# EAGLE design H08R60 (EAGLE 9.2.2)

## Sheet 1 of 2
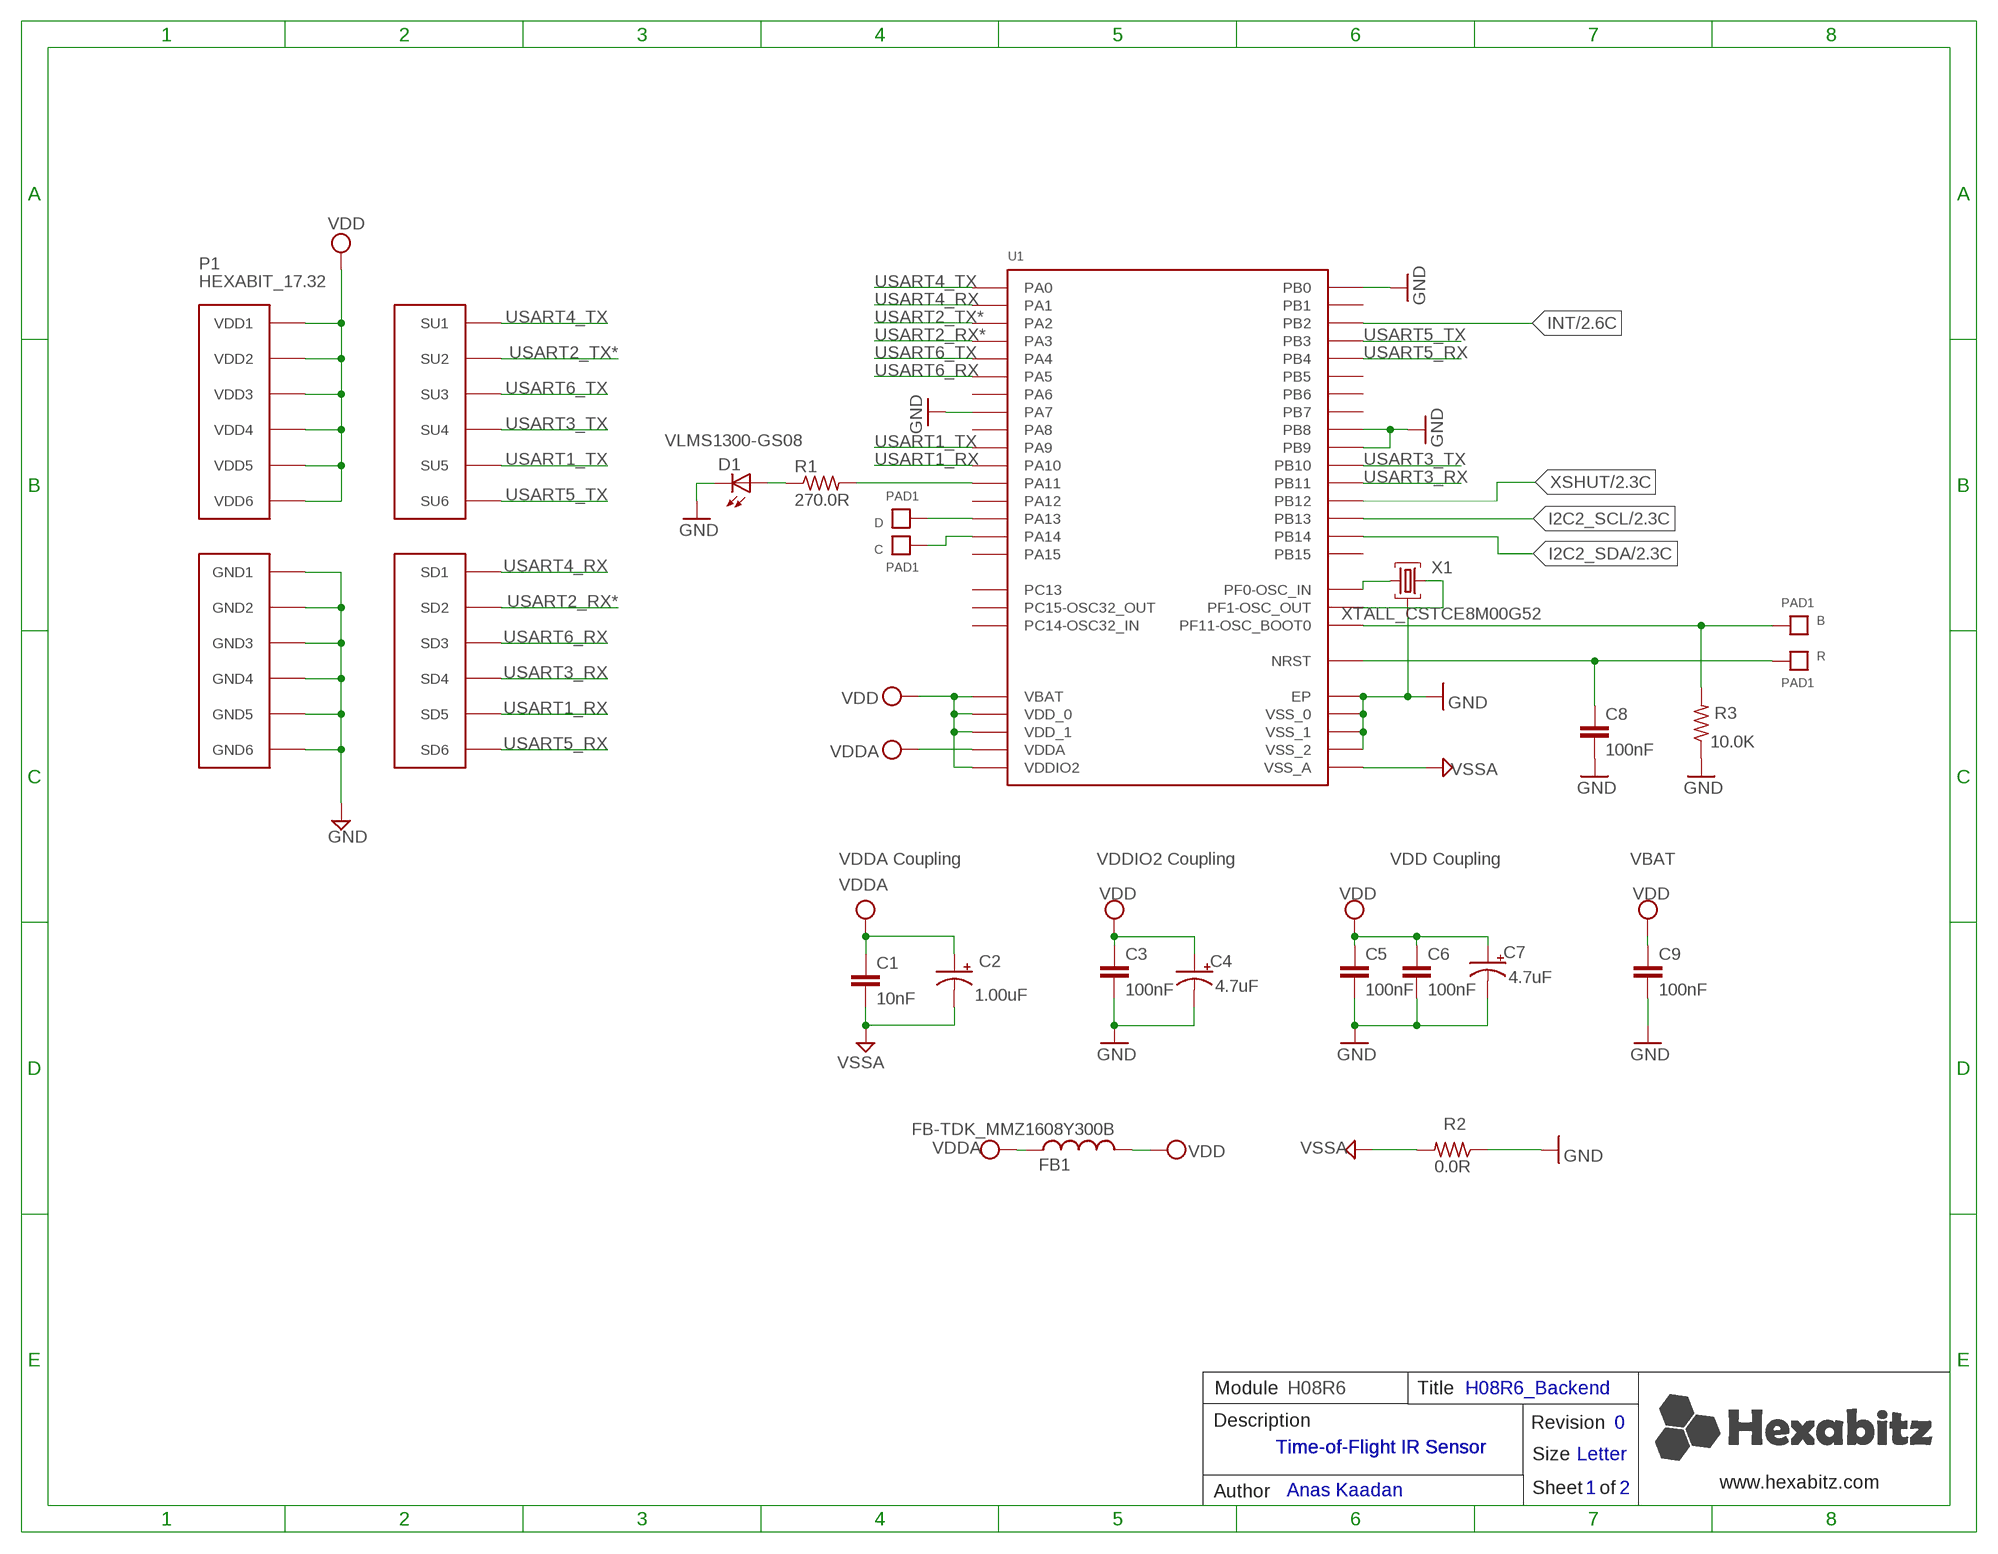
[diagram p0: schematic, sheet 1]

### Parts
B  PAD1  [PAD1]
C  PAD1  [PAD1]
C1  10nF  C-0603  [C-0603]
C2  1.00uF  C-0805  [C-0805]
C3  100nF  C-0603  [C-0603]
C4  4.7uF  C-0805  [C-0805]
C5  100nF  C-0603  [C-0603]
C6  100nF  C-0603  [C-0603]
C7  4.7uF  C-0805  [C-0805]
C8  100nF  C-0603  [C-0603]
C9  100nF  C-0603  [C-0603]
D  PAD1  [PAD1]
D1  VLMS1300-GS08  [VLMS1300-GS08]
FB1  FB-TDK_MMZ1608Y300B  [FB-TDK_MMZ1608Y300B]
P1  HEXABIT_17.32  [HEXABIT_17.32]
R  PAD1  [PAD1]
R1  270.0R  R-0603  [R-0603]
R2  0.0R  R-0603  [R-0603]
R3  10.0K  R-0603  [R-0603]
U1  STM32F091CBU6  [STM32F091CBU6]
X1  XTALL_CSTCE8M00G52  [XTALL_CSTCE8M00G52]

### Nets
B1: B.P$1 B.P$2 R3.2 U1.P$44(PF11-OSC_BOOT0)
GND: C3.2 C4.2(-) C5.2 C6.2 C7.2(-) C8.2 C9.2 D1.C P1.PAD_PD7(GND1) P1.PAD_PD8(GND2) P1.PAD_PD9(GND3) P1.PAD_PD10(GND4) P1.PAD_PD11(GND5) P1.PAD_PD12(GND6) R2.1 R3.1 U1.EP U1.P$17(PA7) U1.P$18(PB0) U1.P$23(VSS_0) U1.P$35(VSS_1) U1.P$45(PB8) U1.P$46(PB9) U1.P$47(VSS_2) X1.P$2
I2C2_SCL: U1.P$26(PB13) ; also sheet 2
I2C2_SDA: U1.P$27(PB14) ; also sheet 2
INT: U1.P$20(PB2) ; also sheet 2
N$3: R1.2 U1.P$32(PA11)
N$4: D1.A R1.1
N$5: U1.P$5(PF0-OSC_IN) X1.P$1
N$6: U1.P$6(PF1-OSC_OUT) X1.P$3
N$7: D.P$1 D.P$2 U1.P$34(PA13)
N$9: C.P$1 C.P$2 U1.P$37(PA14)
R1: C8.1 R.P$1 R.P$2 U1.P$7(NRST)
USART1_RX: P1.PAD_PD5(SD5) U1.P$31(PA10)
USART1_TX: P1.PAD_PU5(SU5) U1.P$30(PA9)
USART2_RX*: P1.PAD_PD2(SD2) U1.P$13(PA3)
USART2_TX*: P1.PAD_PU2(SU2) U1.P$12(PA2)
USART3_RX: P1.PAD_PD4(SD4) U1.P$22(PB11)
USART3_TX: P1.PAD_PU4(SU4) U1.P$21(PB10)
USART4_RX: P1.PAD_PD1(SD1) U1.P$11(PA1)
USART4_TX: P1.PAD_PU1(SU1) U1.P$10(PA0)
USART5_RX: P1.PAD_PD6(SD6) U1.P$40(PB4)
USART5_TX: P1.PAD_PU6(SU6) U1.P$39(PB3)
USART6_RX: P1.PAD_PD3(SD3) U1.P$15(PA5)
USART6_TX: P1.PAD_PU3(SU3) U1.P$14(PA4)
VDD: C3.1 C4.1(+) C5.1 C6.1 C7.1(+) C9.1 FB1.2 P1.PAD_PU7(VDD1) P1.PAD_PU8(VDD2) P1.PAD_PU9(VDD3) P1.PAD_PU10(VDD4) P1.PAD_PU11(VDD5) P1.PAD_PU12(VDD6) U1.P$1(VBAT) U1.P$24(VDD_0) U1.P$36(VDDIO2) U1.P$48(VDD_1) ; also sheet 2
VDDA: C1.1 C2.1(+) FB1.1 U1.P$9(VDDA)
VSSA: C1.2 C2.2(-) R2.2 U1.P$8(VSS_A)
XSHUT: U1.P$25(PB12) ; also sheet 2
Unconnected: U1.P$2(PC13) U1.P$3(PC14-OSC32_IN) U1.P$4(PC15-OSC32_OUT) U1.P$16(PA6) U1.P$19(PB1) U1.P$28(PB15) U1.P$29(PA8) U1.P$33(PA12) U1.P$38(PA15) U1.P$41(PB5) U1.P$42(PB6) U1.P$43(PB7)

### Notes on the sheet
- VDDA Coupling | VDDIO2 Coupling | VDD Coupling | VBAT
- Module | H08R6 | Title | H08R6_Backend
- Description | Revision | 0
- Time-of-Flight IR Sensor | Time-of-Flight IR Sensor
- Size | Letter
- www.hexabitz.com
- Author | Anas Kaadan | Sheet   of | 1 | 2
- C:/Users/Admin/Desktop/logodraft.bmp

## Sheet 2 of 2
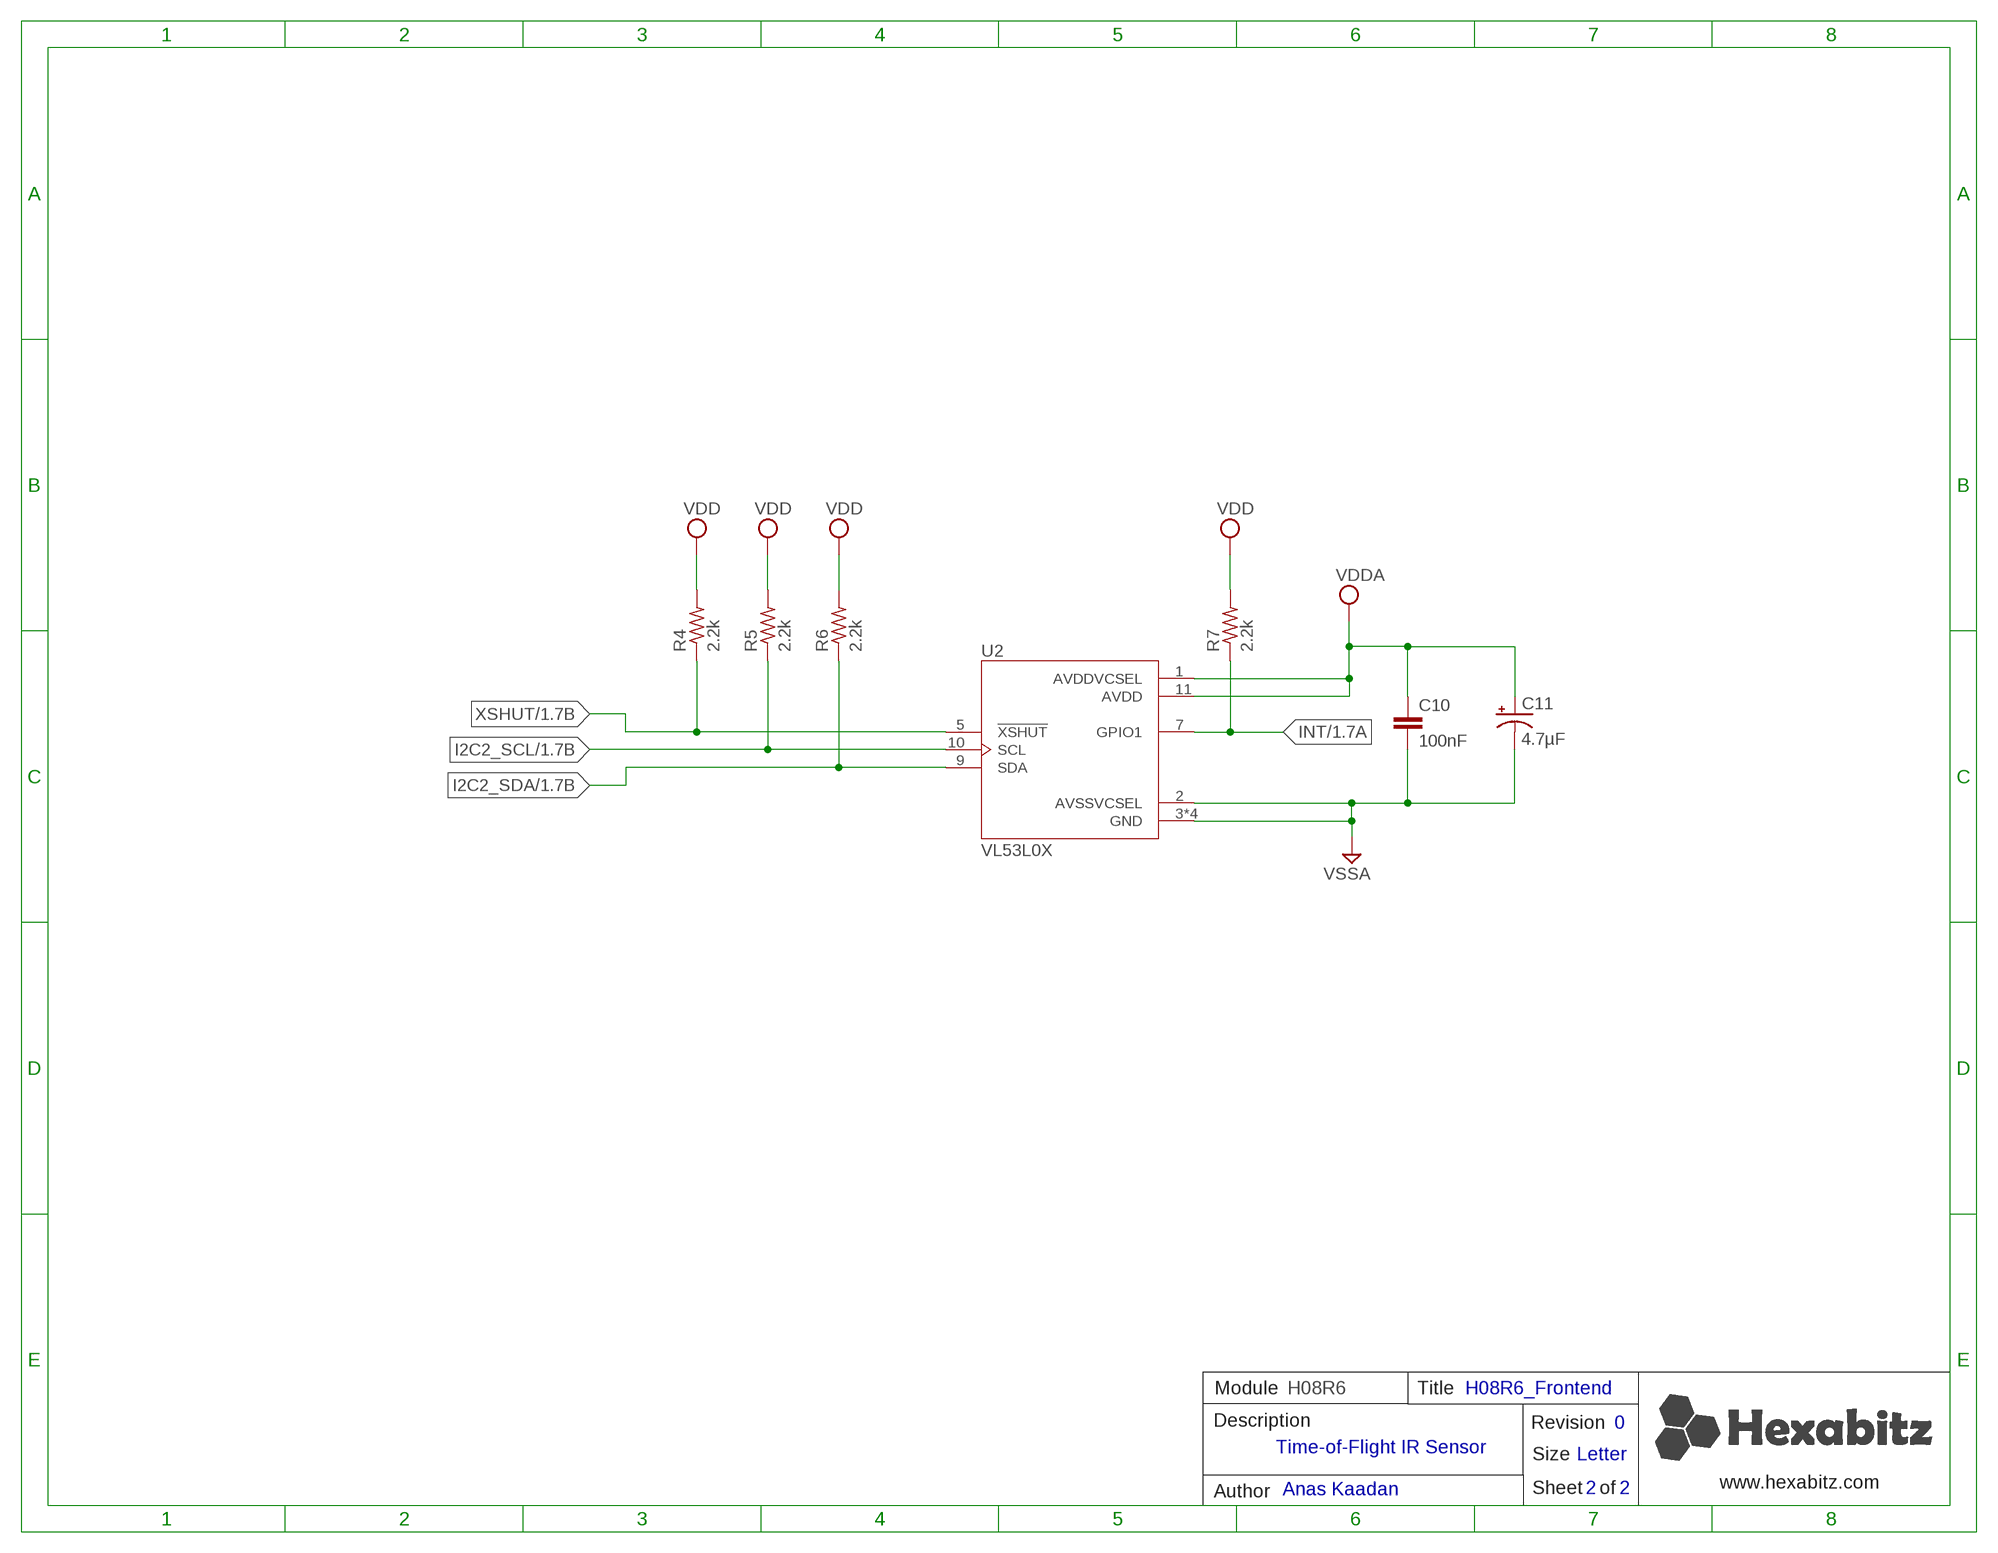
[diagram p1: schematic, sheet 2]

### Parts
C10  100nF  C-0603  [C-0603]
C11  4.7uF  C-0805  [C-0805]
R4  2.2k  R-0603  [R-0603]
R5  2.2k  R-0603  [R-0603]
R6  2.2k  R-0603  [R-0603]
R7  2.2k  R-0603  [R-0603]
U2  VL53L0X  [SENSOR_VL53L0X]

### Nets
AGND: C10.2 C11.2(-) U2.2(AVSSVCSEL) U2.3(GND) U2.4(GND) U2.6(GND) U2.12(GND) ; supply symbol labelled VSSA
I2C2_SCL: R5.1 U2.10(SCL) ; also sheet 1
I2C2_SDA: R6.1 U2.9(SDA) ; also sheet 1
INT: R7.1 U2.7(GPIO1) ; also sheet 1
VDD: C10.1 C11.1(+) R4.2 R5.2 R6.2 R7.2 U2.1(AVDDVCSEL) U2.11(AVDD) ; supply symbol labelled VDDA ; also sheet 1
XSHUT: R4.1 U2.5(!XSHUT) ; also sheet 1

### Notes on the sheet
- Module | H08R6 | Title | H08R6_Frontend
- Description | Revision | 0
- Time-of-Flight IR Sensor
- Size | Letter
- www.hexabitz.com
- Author | Anas Kaadan | Sheet   of | 2 | 2

## Library data of the parts
B C D R = Hexabitz:PAD1
C1 = Hexabitz:C-0603: CAP CER 10% X7R 0603; CAPACITANCE: 10nF; MFN: KEMET; MPN: C0603C103K5RACTU; OCTOPART_URL: https://octopart.com/c0603c103k5ractu-kemet-133094?r=sp&s=R_iPBxLnSmGqhkU2rIMFpg; TOLERANCE: 10%; VOLTAGE_RATING: 50V
C2 = Hexabitz:C-0805: Cap Tant Solid SMD 2012; CAPACITANCE: 1.00uF; MFN: Yageo; MPN: CC0805KKX7R7BB105; OCTOPART_URL: https://octopart.com/cc0805kkx7r7bb105-yageo-8376555?r=sp&s=YKl1wwtkROau_X5nniH2ig; TOLERANCE: 10%; VOLTAGE_RATING: 16V
C3 C6 C8 = Hexabitz:C-0603: CAP CER 10% X7R 0603; CAPACITANCE: 100nF; MFN: KEMET; MPN: C0603C104K8RACTU; OCTOPART_URL: https://octopart.com/c0603c104k8ractu-kemet-145075?r=sp&s=9bS9ASSwSEqMCE9KBEQZ0g; TOLERANCE: 10%; VOLTAGE_RATING: 10V
C4 C7 = Hexabitz:C-0805: Cap Tant Solid SMD 2012; CAPACITANCE: 4.7uF; MFN: Murata; MPN: GRM21BC81E475KA12L; OCTOPART_URL: https://octopart.com/grm21bc81e475ka12l-murata-10331911?r=sp&s=RY3qZSD8T6mG6TC9CHI5qQ; TOLERANCE: 10%; VOLTAGE_RATING: 25V
C5 = Hexabitz:C-0603: CAP CER 10% X7R 0603; CAPACITANCE: 100nF; MFN: KEMET; MPN: C0603C104K8RACTU; OCTOPART_URL: https://octopart.com/c0603c104k8ractu-kemet-145075?r=sp&s=9bS9ASSwSEqMCE9KBEQZ0g; TOLERANCE: 10%; VOLTAGE_RATING: 10
C9 = Hexabitz:C-0603: CAP CER 10% X7R 0603; CAPACITANCE: 100nF; MFN: KEMET; MPN: C0603C104K8RACTU; OCTOPART_URL: https://octopart.com/c0603c104k8ractu-kemet-145075?r=sp&s=9bS9ASSwSEqMCE9KBEQZ0g; TOLERANCE: 10V; VOLTAGE_RATING: 10%
C10 = Hexabitz:C-0603: CAP CER 10% X7R 0603; CAPACITANCE: 100 nF; MFN: KEMET; MPN: C0603C104K8RACTU; OCTOPART_URL: https://octopart.com/0603yc104k4t2a-avx+interconnect+%2F+elco-8120651; TOLERANCE: ±10%; VOLTAGE_RATING: 16.0 V
C11 = Hexabitz:C-0805: Cap Tant Solid SMD 2012; CAPACITANCE: 4.7µF; MFN: Murata; MPN: GRM21BC81E475KA12L; OCTOPART_URL: https://octopart.com/grm21bc81e475ka12l-murata-10331911?r=sp&s=RY3qZSD8T6mG6TC9CHI5qQ; TOLERANCE: 10%; VOLTAGE_RATING: 25V
D1 = Hexabitz:VLMS1300-GS08: Red 0603 130° Clear 54 mcd 2 V Surface Mount ChipLED ; Octopart Url : http://octopart.com/vlms1300-gs08-vishay-21709201; MFN: Vishay; MPN: VLMS1300-GS08; OCTOPART_URL: https://octopart.com/vlms1300-gs08-vishay-21709201?r=sp&s=_gcP4_q8T1SC6PJQPTQ9yA
FB1 = Hexabitz:FB-TDK_MMZ1608Y300B: Ferrite Beads Multi-Layer 30Ohm 25% 100MHz 1.5A 50mOhm DCR 0603; MFN: TDK; MPN: MMZ1608Y300B; OCTOPART_URL: https://octopart.com/mmz1608y300b-tdk-368280?r=sp&s=cd9_2ZEqQ9q9UNBuQgHAiA
P1 = hexabitz_connectors:HEXABIT_?: Hexabitz Hexagon Module Connector Hexagon side length = 17.32mm.
R1 = Hexabitz:R-0603: Thick Film Resistors - SMD 0603; MFN: Yageo; MPN: RC0603FR-07270RL; OCTOPART_URL: https://octopart.com/erj-3geyj271v-panasonic-55560546; RESISTANCE: 270.0 Ohm; TOLERANCE: 1%
R2 = Hexabitz:R-0603: Thick Film Resistors - SMD 0603; MFN: Yageo; MPN: RC0603JR-070RL; OCTOPART_URL: https://octopart.com/crcw06030000z0eahp-vishay-44320230; RESISTANCE: 0.0 Ohm
R3 = Hexabitz:R-0603: Thick Film Resistors - SMD 0603; MFN: Yageo; MPN: RC0603JR-0710KL; OCTOPART_URL: https://octopart.com/crcw060310k0jneb-vishay+dale-46603268; RESISTANCE: 10.0K Ohm; TOLERANCE: 5%
R4-R7 = Hexabitz:R-0603: Thick Film Resistors - SMD 0603; MFN: Yageo; MPN: RC0603FR-07270RL; OCTOPART_URL: https://octopart.com/crcw06032k20fkea-vishay-40018987; RESISTANCE: 2.2 kΩ; TOLERANCE: ±1%
U1 = Hexabitz:STM32F091CBU6: Description : ARM-based 32-bit MCU, CAN, 12 timers, ADC, DAC & Comm. Interface, 2 to 3.6 V, -40 to 85 degC, 48-Pin UFQFPN, RoHS, Tray ;Parameter : Ciiva URL : https://ciiva.com/part/STM32F091CBU6-20240708, CiivaID : 20240708, Clock Speed : 48000000.0 Hz, Lifecycle Status : Active, Mounting Style : Surface Mount, Number of Pins : 48, Octopart Url : https://octopart.com/stm32f091cbu6-stmicroelectronics-51988677, OctopartID : 5f4f955c32ec8088, RAM Memory Size : 32768 B, REACH SVHC Compliance : No SVHC, RoHS : Compliant,; MFN: STMicroelectronics; MPN: STM32F091CBU6; OCTOPART_URL: https://octopart.com/stm32f091cbu6-stmicroelectronics-51988677?r=sp&s=bU6fpgsrTZOxHyt7jkfh3w
U2 = Hexabitz:VL53L0X: Time-of-Flight Ranging & Gesture Detection Sensor; MFN: STMicroelectronics; MPN: VL53L0CXV0DH/1; OCTOPART_URL: http://octopart.com/vl53l0cxv0dh%2F1-stmicroelectronics-71168165
X1 = Hexabitz:XTALL_CSTCE8M00G52: MURATA CSTCE8M00G52-R0 RESONATOR, SMD, 8MHZ ; Octopart Url : https://octopart.com/cstce8m00g52-r0-murata-7145559; MFN: Murata; MPN: CSTCE8M00G52Z-R0; OCTOPART_URL: https://octopart.com/cstce8m00g52z-r0-murata-17755941?r=sp&s=JDnNJnrHQhyS8Zk4ofFWXw

## Board
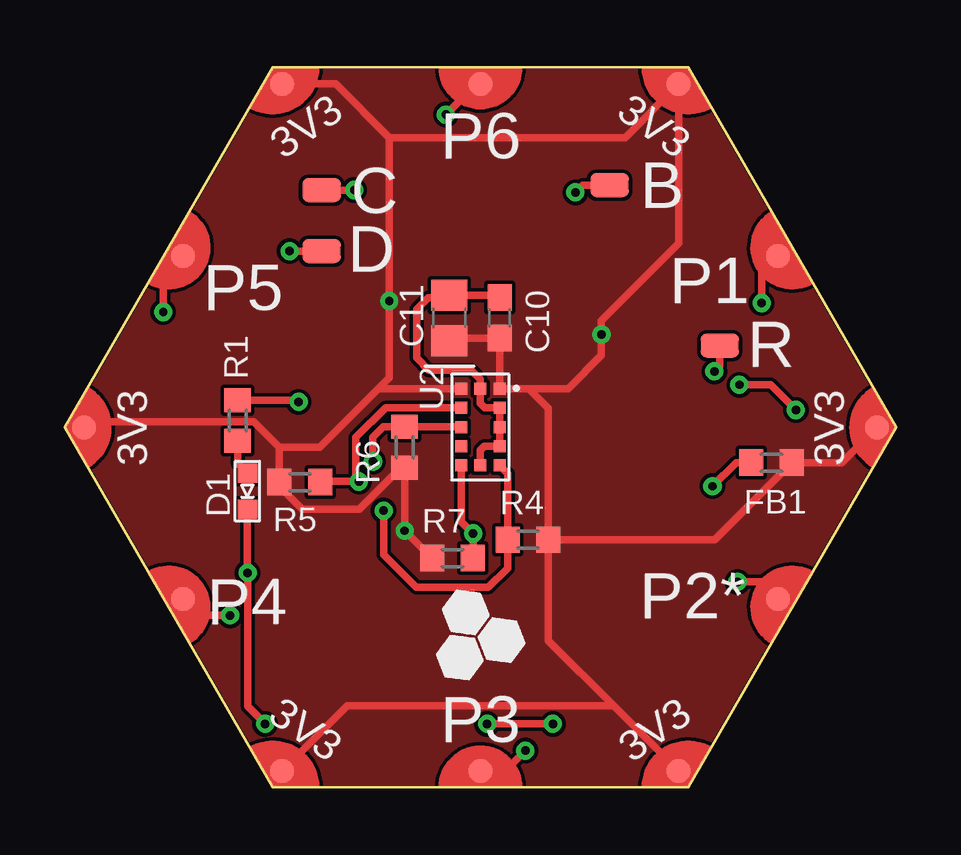
[diagram p2: board, top side]
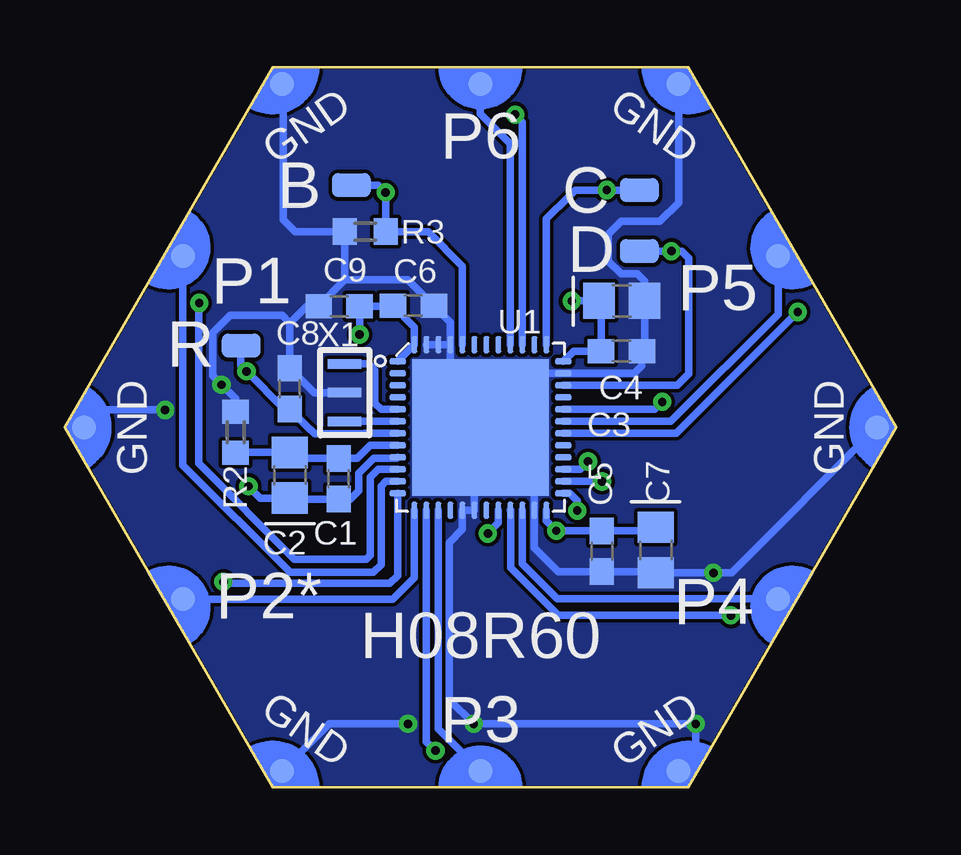
[diagram p3: board, bottom side, seen from below]

Size 34.64 x 30 mm. Coordinates in mm from the lower left corner, seen from the top.
Copper layers (1*16): Top 0.035mm / dielectric 1.5mm / Bottom 0.035mm
Design rules "2_layer": minimum track width 7mil, minimum drill 10mil, track to track 6mil, track to pad 6mil, pad to pad 6mil, via to via 6mil, smd to smd 0mil, copper to edge 1mil, drill to drill 8mil, minimum pad ring 10mil, minimum via ring 8mil, stop-mask expansion 2mil, vias tented up to drill 15mil, thermal gap 10mil

### Footprints (pad centres in the part's own frame; a part is rotated, then mirrored left to right if it is on the bottom)
PAD1 = smd 1.6 x 1: P$1 0,0 | smd 1.6 x 1 bottom: P$2 0,0
C-0603 = smd 1.1 x 1: 1 -0.85,0; 2 0.85,0
C-0805 = smd 1.3 x 1.5: 1 -0.95,0; 2 0.95,0
VLMS1300-GS08 = smd 0.8 x 0.8: A 0,0.75; C 0,-0.75
FB-TDK_MMZ1608Y300B = smd 1 x 1.1: 1 -0.85,0; 2 0.85,0
HEXABIT_17.32 = smd 1 x 1 bottom: PAD_PD1 12.39,7.15; PAD_PD2 12.39,-7.15; PAD_PD3 0,-14.31; PAD_PD4 -12.39,-7.15; PAD_PD5 -12.39,7.15; PAD_PD6 0,14.31; PAD_PD7 8.26,14.31; PAD_PD8 16.52,0; PAD_PD9 8.26,-14.31; PAD_PD10 -8.26,-14.31; PAD_PD11 -16.52,0; PAD_PD12 -8.26,14.31 | smd 1 x 1: PAD_PU1 12.39,7.15; PAD_PU2 12.39,-7.15; PAD_PU3 0,-14.31; PAD_PU4 -12.39,-7.15; PAD_PU5 -12.39,7.15; PAD_PU6 0,14.31; PAD_PU7 8.26,14.31; PAD_PU8 16.52,0; PAD_PU9 8.26,-14.31; PAD_PU10 -8.26,-14.31; PAD_PU11 -16.52,0; PAD_PU12 -8.26,14.31
R-0603 = smd 1 x 1.1: 1 -0.85,0; 2 0.85,0
STM32F091CBU6 = smd 5.7 x 5.7: EP 0,0 | smd 0.25 x 0.7: P$1 -2.75,-3.45; P$2 -2.25,-3.45; P$3 -1.75,-3.45; P$4 -1.25,-3.45; P$5 -0.75,-3.45; P$6 -0.25,-3.45; P$7 0.25,-3.45; P$8 0.75,-3.45; P$9 1.25,-3.45; P$10 1.75,-3.45; P$11 2.25,-3.45; P$12 2.75,-3.45; P$25 2.75,3.45; P$26 2.25,3.45; P$27 1.75,3.45; P$28 1.25,3.45; P$29 0.75,3.45; P$30 0.25,3.45; P$31 -0.25,3.45; P$32 -0.75,3.45; P$33 -1.25,3.45; P$34 -1.75,3.45; P$35 -2.25,3.45; P$36 -2.75,3.45 | smd 0.7 x 0.25: P$13 3.45,-2.75; P$14 3.45,-2.25; P$15 3.45,-1.75; P$16 3.45,-1.25; P$17 3.45,-0.75; P$18 3.45,-0.25; P$19 3.45,0.25; P$20 3.45,0.75; P$21 3.45,1.25; P$22 3.45,1.75; P$23 3.45,2.25; P$24 3.45,2.75; P$37 -3.45,2.75; P$38 -3.45,2.25; P$39 -3.45,1.75; P$40 -3.45,1.25; P$41 -3.45,0.75; P$42 -3.45,0.25; P$43 -3.45,-0.25; P$44 -3.45,-0.75; P$45 -3.45,-1.25; P$46 -3.45,-1.75; P$47 -3.45,-2.25; P$48 -3.45,-2.75
SENSOR_VL53L0X = smd 0.5 x 0.5: 1 -1.6,0.8; 2 -0.8,0.8; 3 0,0.8; 4 0.8,0.8; 5 1.6,0.8; 6 1.6,0; 7 1.6,-0.8; 8 0.8,-0.8; 9 0,-0.8; 10 -0.8,-0.8; 11 -1.6,-0.8; 12 -1.6,0
XTALL_CSTCE8M00G52 = smd 1.4 x 0.4: P$1 0,1.2; P$2 0,0; P$3 0,-1.2

### Placement (x,y rotation side)
B  22.7,25.1 0 top
C  10.7,24.89 0 top
C1  23.23,12.86 90 bottom
C2  25.26,13.01 90 bottom
C3  11.44,18.18 0 bottom
C4  11.43,20.27 0 bottom
C5  12.26,9.84 270 bottom
C6  20.11,20.07 0 bottom
C7  10.01,9.89 270 bottom
C8  25.26,16.62 90 bottom
C9  23.21,20.06 180 bottom
C10  18.12,19.57 90 top
C11  16.02,19.56 90 top
D  10.7,22.35 180 top
D1  7.61,12.35 0 top
FB1  29.45,13.53 0 top
P1  17.32,15 0 top
R  27.29,18.41 0 top
R1  7.2,15.29 90 top
R2  27.52,14.8 270 bottom
R3  22.12,23.16 0 bottom
R4  19.3,10.32 0 top
R5  9.8,12.72 180 top
R6  14.16,14.17 270 top
R7  16.15,9.56 180 top
U1  17.32,15 270 bottom
U2  17.32,15.01 270 top
X1  22.98,16.45 0 bottom

### Tracks (layer width: path | path; a pad name or v marks a point on that pad's centre or on a via)
AGND
  Top 0.305: U2.4 U2.3 U2.2 17.51,15.81 17.32,16 U2.12 17.32,17.02 16.95,17.39 15.17,17.39 14.66,17.89 14.66,19.93 15.14,20.41 16.02,20.41 C11.2 18.01,20.51 C10.2 | U2.6 17.32,14.05 17.49,14.21 U2.4 | U2.4
B1  (via drill 0.35)
  Top 0.305: B.P$1 21.58,25.1 v21.27,24.8
  Bottom 0.305: U1.P$44 18.07,21.73 19.5,23.16 R3.2 v21.27,24.8 21.58,25.1 B.P$1
GND  (via drill 0.35)
  Top 0.305: v17.6,2.65 v20.34,2.65 | D1.C v7.61,8.95 v7.62,8.94 7.62,3.38 v8.35,2.65 | v30.46,15.73 29.41,16.78 v28.11,16.78
  Bottom 0.305: U1.EP 18.57,16.25 U1.P$45 | U1.EP 17.31,13.31 17.57,13.05 U1.P$18 U1.P$17 18.07,10.75 18.61,10.2 18.61,3.66 v17.6,2.65 v8.35,2.65 8.35,1.4 P1.PAD_PD10 | U1.EP 15.07,17.25 U1.P$35 10.92,17.25 10.59,17.57 C3.2 10.48,18.3 C4.2 10.48,21.1 10.79,21.4 11.46,21.4 11.99,21.93 11.99,23.05 11.45,23.58 9.84,23.58 9.06,24.36 P1.PAD_PD12 | U1.EP 15.07,12.75 U1.P$23 15.07,9.98 14.08,8.99 C5.2 10.06,8.99 C7.2 v7.62,8.94 6.86,8.94 P1.PAD_PD11 | U1.P$45 U1.P$46 U1.P$47 | U1.P$45 18.57,19.37 C6.2 20.34,21.14 22.97,21.14 | X1.P$2 24.24,16.45 C8.2 25.26,19.35 | 25.26,19.35 24.55,20.06 C9.2 22.97,21.14 | 25.26,19.35 25.58,19.67 27.75,19.67 28.48,18.95 28.48,17.15 v28.11,16.78 27.52,16.19 R2.1 | v20.34,2.65 23.62,2.65 P1.PAD_PD9 | P1.PAD_PD7 25.54,29.27 25.54,23.66 25.04,23.16 R3.1 22.97,21.15 22.97,21.14 | P1.PAD_PD8 33.11,15.73 v30.46,15.73
  pour Bottom (no thermals): 8.66,0 25.98,0 34.64,15 25.98,30 8.66,30 0,15
I2C2_SCL  (via drill 0.35)
  Top 0.305: U2.10 14.85,15.81 14.84,15.83 13.36,15.83 12.13,14.6 12.13,12.87 v12.25,12.75 10.67,12.75 R5.1
  Bottom 0.305: v12.25,12.75 U1.P$26
I2C2_SDA  (via drill 0.35)
  Top 0.305: U2.9 16.51,15.02 R6.1 13.27,15.02 12.84,14.59 v12.84,13.58
  Bottom 0.305: U1.P$27 13.17,13.25 v12.84,13.58
INT  (via drill 0.35)
  Top 0.305: R7.1 17.01,9.57 v17.01,10.58 16.52,11.07 U2.7
  Bottom 0.305: U1.P$20 16.57,11.02 v17.01,10.58
N$3  (via drill 0.35)
  Top 0.305: v9.75,16.07 9.67,16.14 R1.2
  Bottom 0.305: U1.P$32 10.06,15.75 v9.75,16.07
N$4
  Top 0.305: R1.1 7.2,13.5 D1.A
N$5
  Bottom 0.305: U1.P$5 21.46,15.75 21.72,16.01 21.72,17.39 21.98,17.65 X1.P$1
N$6
  Bottom 0.305: U1.P$6 X1.P$3
N$7  (via drill 0.35)
  Top 0.305: D.P$1 v9.37,22.35
  Bottom 0.305: U1.P$34 9.13,16.75 8.64,17.24 8.64,22.05 8.93,22.35 v9.37,22.35 D.P$1
N$9  (via drill 0.35)
  Top 0.305: C.P$1 v12.05,24.89 v12.06,24.89
  Bottom 0.305: U1.P$37 14.57,23.69 13.62,24.64 13.37,24.89 v12.06,24.89 C.P$1
R1  (via drill 0.35)
  Top 0.305: R.P$1 27.29,17.56 v27.07,17.34
  Bottom 0.305: U1.P$7 22.15,14.75 22.15,14.74 24.22,14.74 24.39,14.91 24.41,14.91 C8.1 25.5,15.77 v27.07,17.34 27.3,17.57 R.P$1
USART1_RX
  Bottom 0.305: U1.P$31 9.38,15.25 4.92,19.72 4.92,22.14 P1.PAD_PD5
USART1_TX  (via drill 0.35)
  Top 0.305: v4.1,19.81 4.1,21.32 P1.PAD_PU5
  Bottom 0.305: U1.P$30 9.16,14.75 v4.1,19.81
USART2_RX*
  Bottom 0.305: U1.P$13 20.07,8.74 20.96,7.84 P1.PAD_PD2
USART2_TX*  (via drill 0.35)
  Top 0.305: v28.03,8.56 29,8.56 P1.PAD_PU2
  Bottom 0.305: U1.P$12 20.77,8.82 21.09,8.5 27.97,8.5 v28.03,8.56
USART3_RX
  Bottom 0.305: U1.P$22 15.57,9.31 14.12,7.87 4.95,7.87 P1.PAD_PD4
USART3_TX  (via drill 0.35)
  Top 0.305: v6.89,7.17 5.61,7.17 P1.PAD_PU4
  Bottom 0.305: U1.P$21 16.06,9.16 14.07,7.17 v6.89,7.17
USART4_RX
  Bottom 0.305: U1.P$11 21.26,12.75 21.46,12.55 21.46,9.28 21.78,8.96 25.24,8.96 29.72,13.43 P1.PAD_PD1
USART4_TX  (via drill 0.35)
  Top 0.305: v29.04,20.18 29.04,21.48 P1.PAD_PU1
  Bottom 0.305: U1.P$10 21.59,13.25 21.92,12.92 21.92,9.67 22.07,9.52 25.08,9.52 29.06,13.5 29.06,20.15 v29.04,20.18
USART5_RX
  Bottom 0.305: U1.P$40 16.07,26.83 17.32,28.08 P1.PAD_PD6
USART5_TX  (via drill 0.35)
  Top 0.305: v15.88,28.03 17.15,29.31 P1.PAD_PU6
  Bottom 0.305: U1.P$39 15.57,27.73 v15.88,28.03
USART6_RX
  Bottom 0.305: U1.P$15 19.07,2.44 P1.PAD_PD3
USART6_TX  (via drill 0.35)
  Top 0.305: v19.19,1.53 18.35,0.69 P1.PAD_PU3
  Bottom 0.305: U1.P$14 19.57,1.91 v19.19,1.53
VDD  (via drill 0.35)
  Top 0.305: R7.2 v14.16,10.69 R6.2 13.99,13.32 12.27,11.6 9.89,11.6 8.94,12.55 R5.2 8.94,14.18 | U2.11 13.05,16.61 | 22.36,19.45 v22.36,18.87 22.36,18 20.98,16.61 19.33,16.61 | P1.PAD_PU8 32.37,13.53 FB1.2 27.09,10.32 R4.2 | P1.PAD_PU11 1.05,15.25 7.88,15.25 8.94,14.18 | R4.2 20.15,6.12 22.87,3.4 | 22.87,3.4 P1.PAD_PU9 | P1.PAD_PU10 11.77,3.4 22.87,3.4 | 22.36,19.45 25.58,22.67 P1.PAD_PU7 23.34,27.07 13.52,27.07 | 22.36,19.45 | 13.52,27.07 11.28,29.31 P1.PAD_PU12 | 13.52,27.07 v13.52,20.27 13.52,17.08 13.05,16.61 | 13.05,16.61 10.62,14.18 8.94,14.18 | 19.33,16.61 20.15,15.79 R4.2 | 19.33,16.61 U2.1 C10.1 | C10.1 | C11.1 16.13,18.72 C10.1
  Bottom 0.305: U1.P$1 U1.P$48 20.07,19.17 C6.1 20.97,20.06 C9.1 v22.36,18.88 v22.36,18.87 | U1.P$36 13.44,18.18 C3.1 12.29,20.18 C4.1 v13.52,20.27 | U1.P$24 14.57,11.1 v14.16,10.69 C5.1 10.16,10.69 C7.1
  pour Top (no thermals): 8.66,0 25.98,0 34.64,15 25.98,30 8.66,30 0,15
VDDA  (via drill 0.35)
  Top 0.305: v26.99,12.55 27.97,13.53 FB1.1
  Bottom 0.305: U1.P$9 20.81,13.71 21.78,13.71 22.39,13.1 22.39,12.37 22.75,12 23.22,12 C1.1 25.22,12.01 C2.1 26.49,12.06 v26.99,12.55
VSSA
  Bottom 0.305: U1.P$8 21.91,14.25 22.45,13.71 C1.2 25.02,13.71 C2.2 R2.2
XSHUT  (via drill 0.35)
  Top 0.305: U2.5 18.45,13.08 R4.1 18.45,9.14 17.65,8.34 14.65,8.34 13.29,9.7 v13.29,11.53
  Bottom 0.305: v13.29,11.53 13.29,11.94 13.59,12.25 U1.P$25

### Text on the board
tPlace: 3V3 | P6 | 3V3 | P1 | P5 | 3V3 | 3V3 | P2* | P4 | 3V3 | P3 | 3V3
bPlace: GND | P6 | GND | P1 | P5 | GND | GND | P2* | P4 | H08R60 | GND | P3 | GND
bNames: B | C | D | R